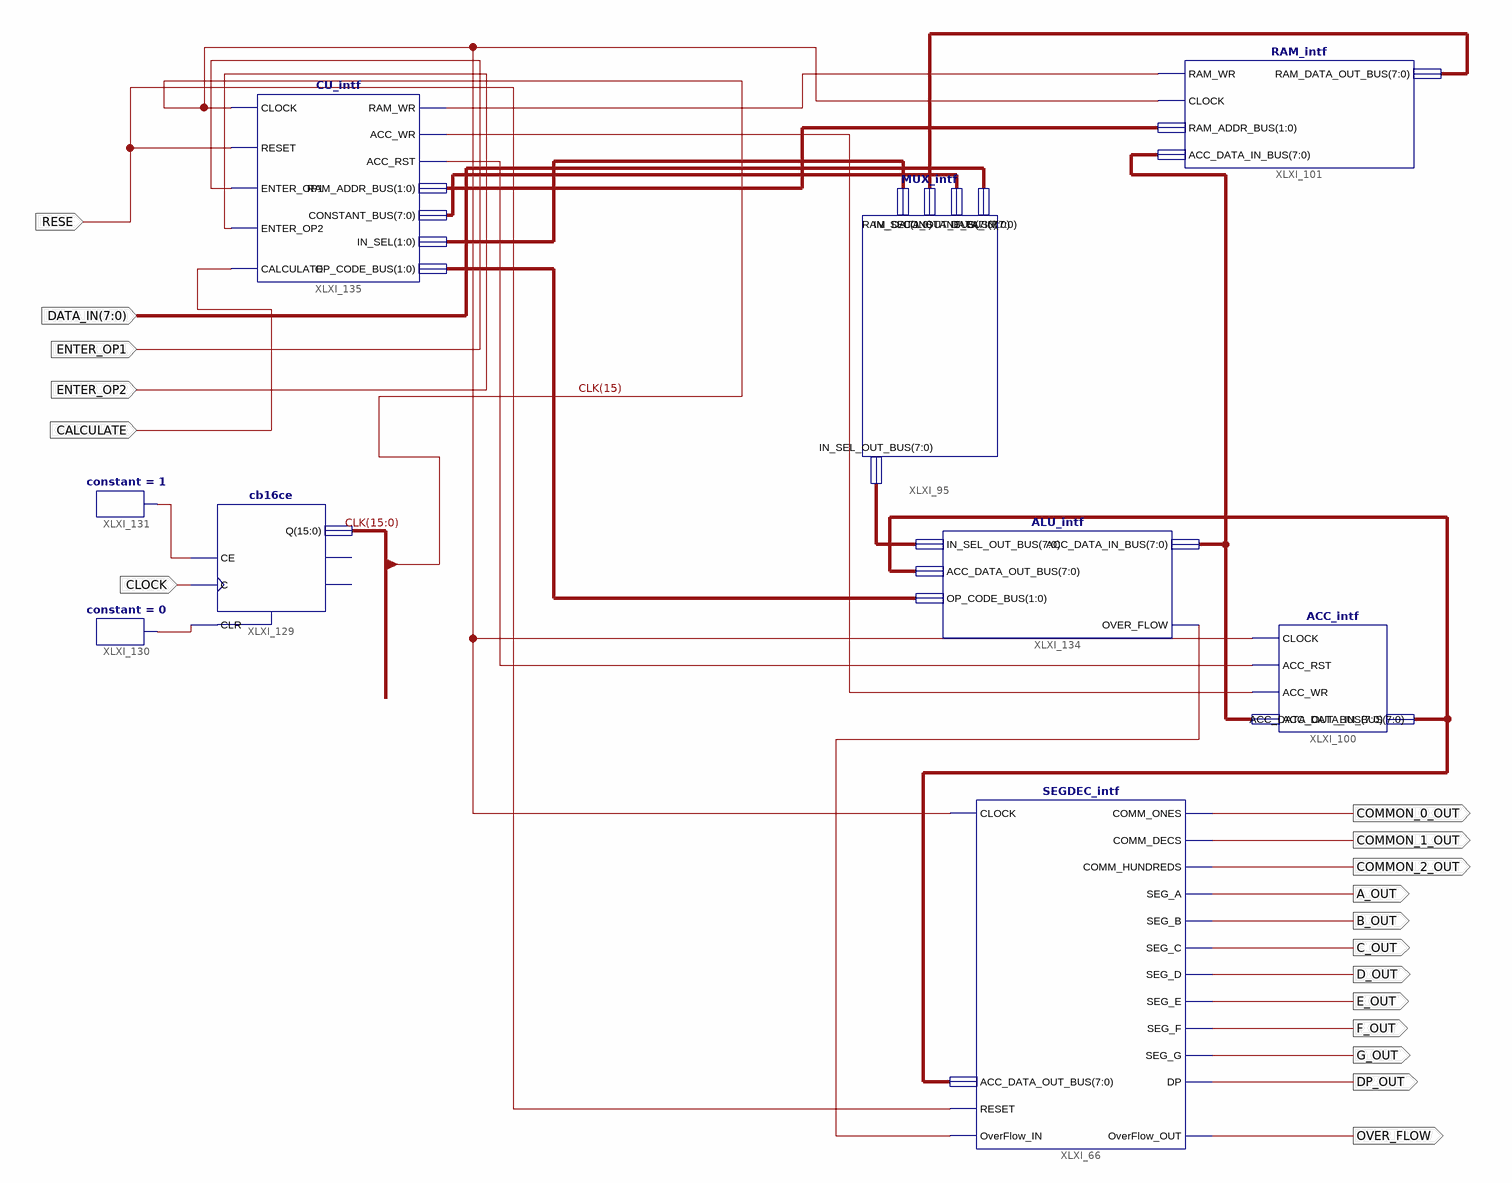
[diagram p0: schematic sheet 1]
// Xilinx ISE schematic TopLevel.sch (spartan3a) as structural Verilog: 9 symbols, 18 ports
module TopLevel (
  input  [7:0] DATA_IN,
  input  ENTER_OP1,
  input  ENTER_OP2,
  input  CALCULATE,
  input  CLOCK,
  input  RESE,
  output COMMON_0_OUT,
  output COMMON_1_OUT,
  output A_OUT,
  output B_OUT,
  output C_OUT,
  output D_OUT,
  output E_OUT,
  output F_OUT,
  output G_OUT,
  output DP_OUT,
  output OVER_FLOW,
  output COMMON_2_OUT
);

  wire XLXN_223, XLXN_242, XLXN_243, XLXN_250, XLXN_287, XLXN_288;
  wire [1:0] XLXN_224, XLXN_234, XLXN_235;
  wire [7:0] XLXN_213, XLXN_240, XLXN_246, XLXN_248, XLXN_249;
  wire [15:0] CLK;

  SEGDEC_intf XLXI_66 (
    .CLOCK(CLK[15]), .RESET(RESE), .OverFlow_IN(XLXN_250), .ACC_DATA_OUT_BUS(XLXN_246),
    .COMM_ONES(COMMON_0_OUT), .COMM_DECS(COMMON_1_OUT), .COMM_HUNDREDS(COMMON_2_OUT), .SEG_A(A_OUT),
    .SEG_B(B_OUT), .SEG_C(C_OUT), .SEG_D(D_OUT), .SEG_E(E_OUT), .SEG_F(F_OUT), .SEG_G(G_OUT), .DP(DP_OUT),
    .OverFlow_OUT(OVER_FLOW));
  MUX_intf XLXI_95 (
    .DATA_IN(DATA_IN), .CONSTANT_BUS(XLXN_240), .RAM_DATA_OUT_BUS(XLXN_249), .IN_SEL(XLXN_234),
    .IN_SEL_OUT_BUS(XLXN_213));
  ACC_intf XLXI_100 (
    .CLOCK(CLK[15]), .ACC_RST(XLXN_243), .ACC_WR(XLXN_242), .ACC_DATA_IN_BUS(XLXN_248),
    .ACC_DATA_OUT_BUS(XLXN_246));
  RAM_intf XLXI_101 (
    .RAM_WR(XLXN_223), .CLOCK(CLK[15]), .RAM_ADDR_BUS(XLXN_224), .ACC_DATA_IN_BUS(XLXN_248),
    .RAM_DATA_OUT_BUS(XLXN_249));
  cb16ce XLXI_129 (.C(CLOCK), .CE(XLXN_287), .CLR(XLXN_288), .Q(CLK));  // open: CEO, TC
  constant #(.CValue("0")) XLXI_130 (.O(XLXN_288));
  constant #(.CValue("1")) XLXI_131 (.O(XLXN_287));
  ALU_intf XLXI_134 (
    .IN_SEL_OUT_BUS(XLXN_213), .ACC_DATA_OUT_BUS(XLXN_246), .OP_CODE_BUS(XLXN_235), .OVER_FLOW(XLXN_250),
    .ACC_DATA_IN_BUS(XLXN_248));
  CU_intf XLXI_135 (
    .CLOCK(CLK[15]), .RESET(RESE), .ENTER_OP1(ENTER_OP1), .ENTER_OP2(ENTER_OP2), .CALCULATE(CALCULATE),
    .RAM_WR(XLXN_223), .ACC_WR(XLXN_242), .ACC_RST(XLXN_243), .RAM_ADDR_BUS(XLXN_224),
    .CONSTANT_BUS(XLXN_240), .IN_SEL(XLXN_234), .OP_CODE_BUS(XLXN_235));
endmodule
